# EasyEDA Pro project Schematic.epro

# Schematic Schematic1
Board Name: Board1; Create Date: 2026-07-30; Page Name: P1; Project Name: USB HUB; Schematic Name: Schematic1; Update Date: 2026-07-30; Company: EasyEDA.com; Page Size: A4; Version: V1.0
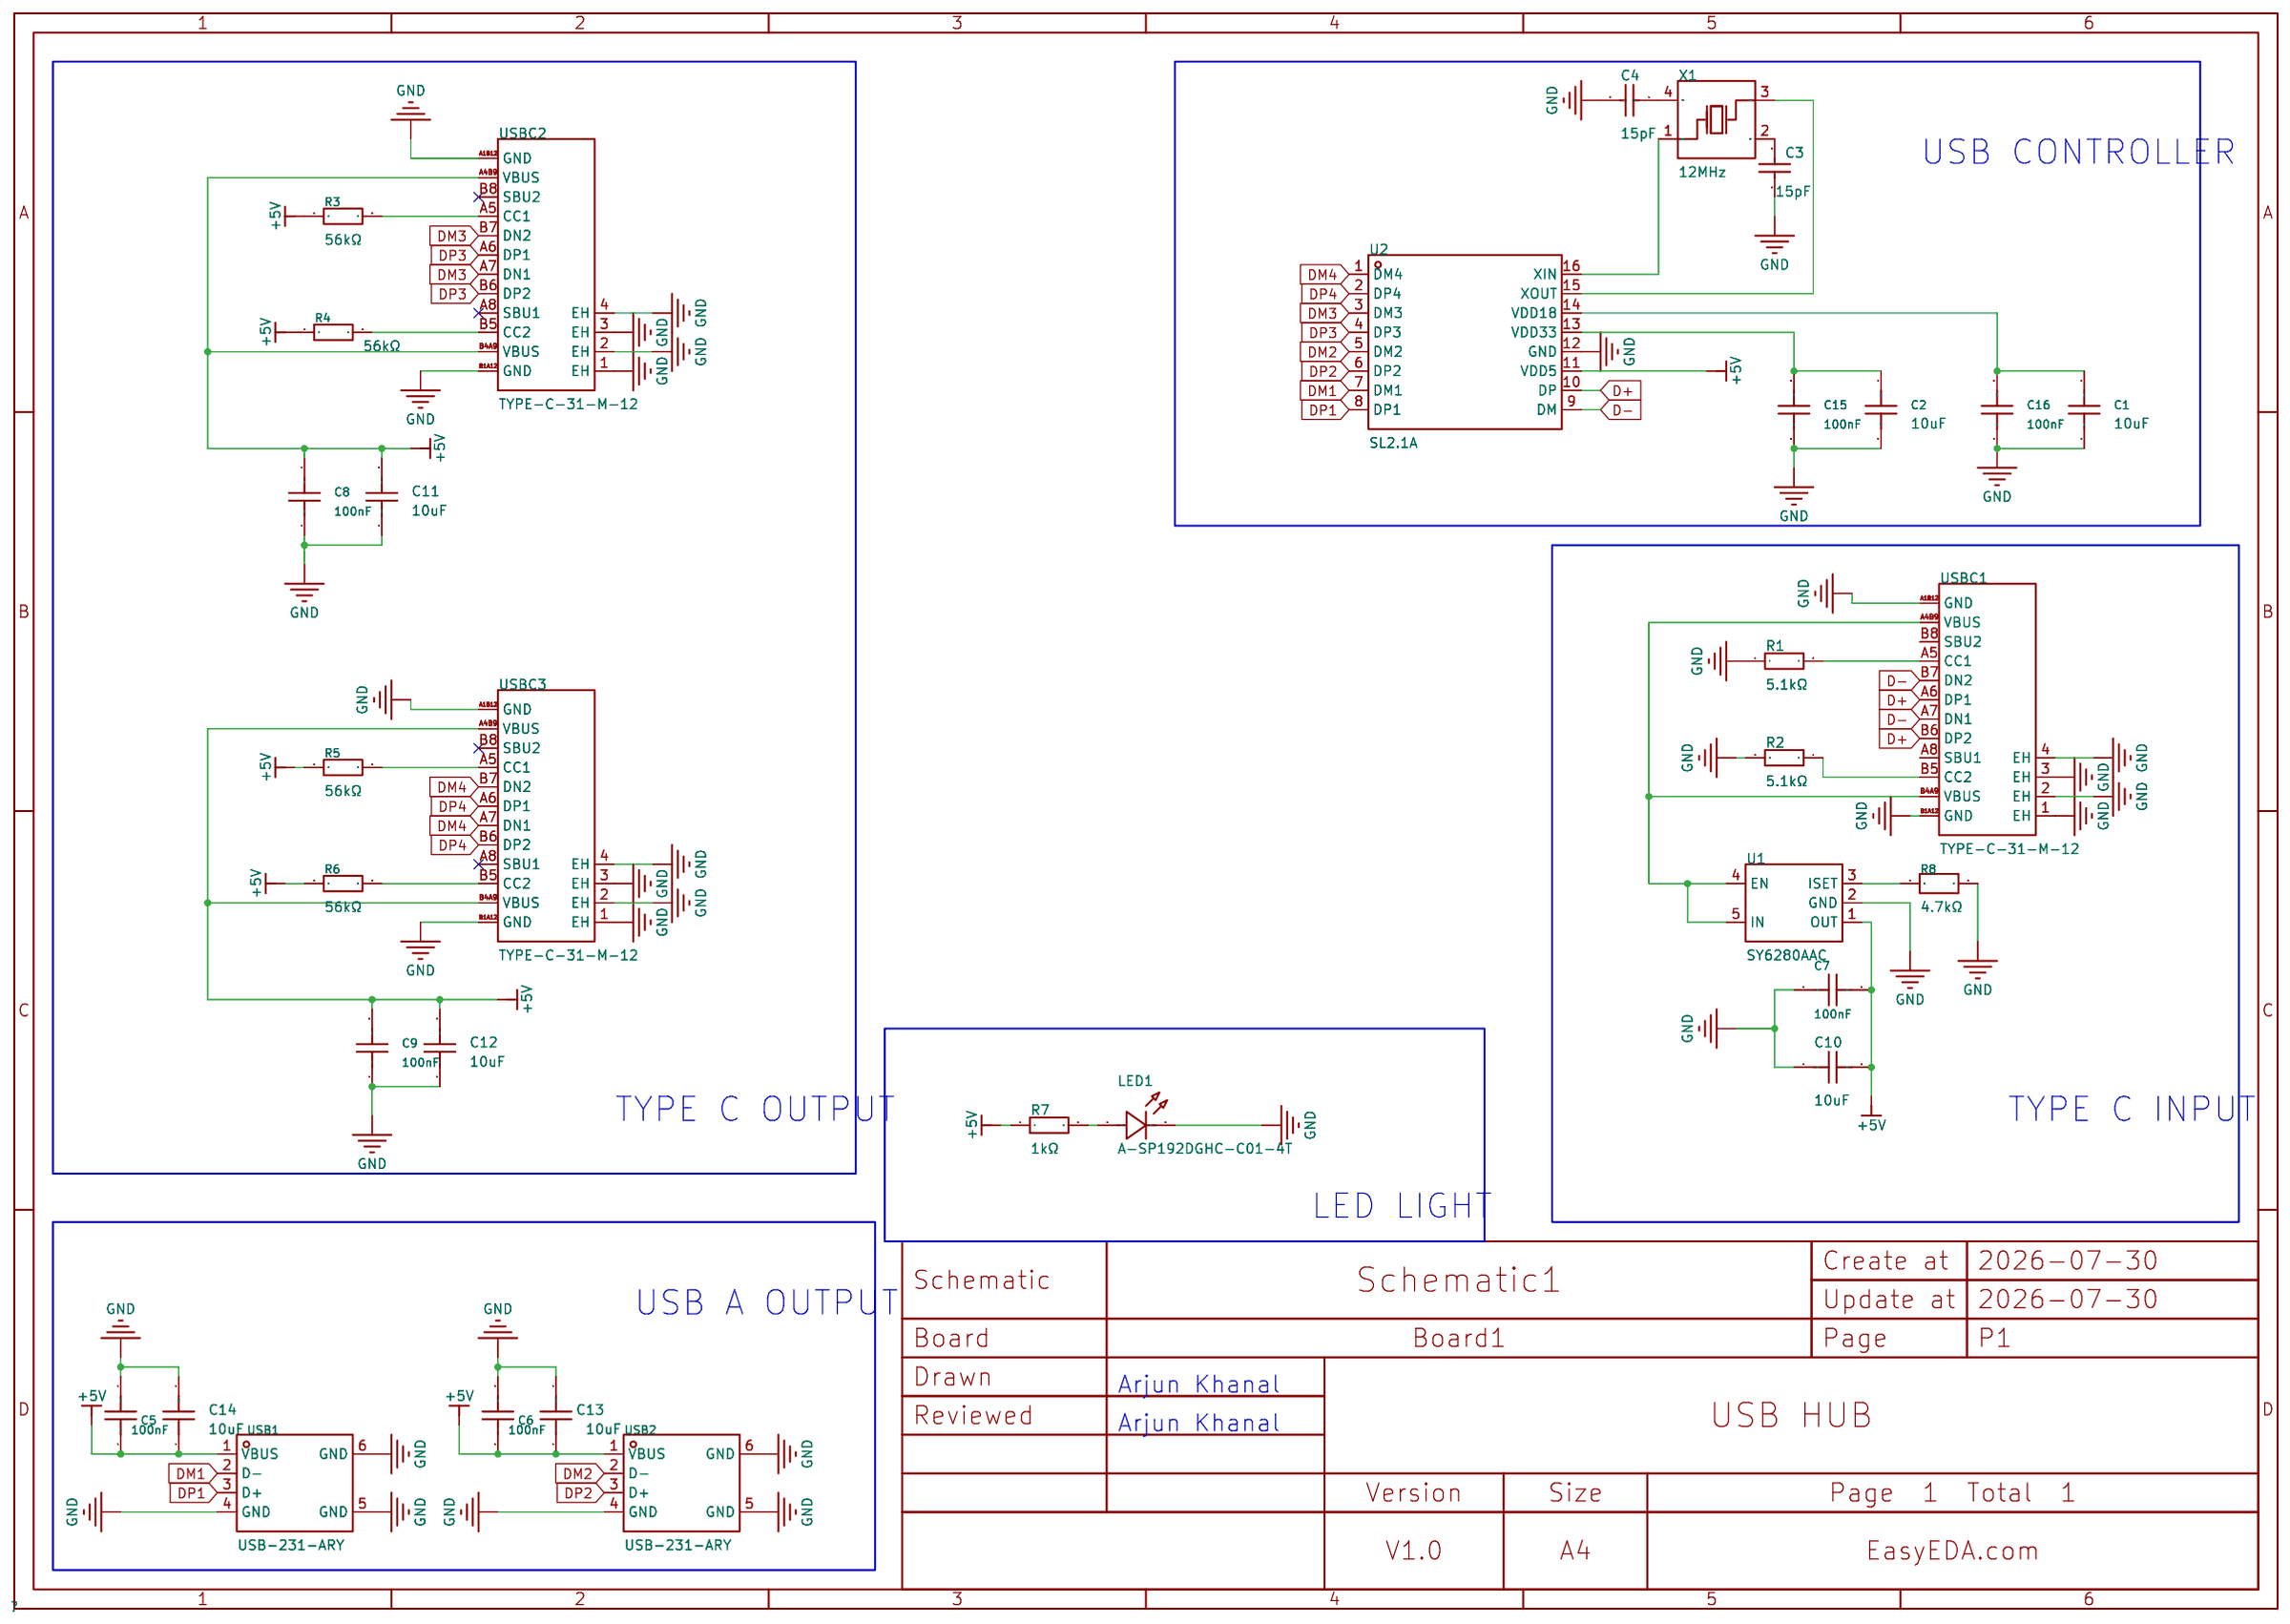
[diagram p0: schematic sheet]

## Parts
C1  10uF  [C0603]
C2  10uF  [C0603]
C3  15pF  [C0603]
C4  15pF  [C0603]
C5  100nF  [C0603]
C6  100nF  [C0603]
C7  100nF  [C0603]
C8  100nF  [C0603]
C9  100nF  [C0603]
C10  10uF  [C0805]
C11  10uF  [C0805]
C12  10uF  [C0805]
C13  10uF  [C0805]
C14  10uF  [C0805]
C15  100nF  [C0603]
C16  100nF  [C0603]
LED1  A-SP192DGHC-C01-4T  [LED0603-FD]
R1  5.1kΩ  [R0603]
R2  5.1kΩ  [R0603]
R3  56kΩ  [R0603]
R4  56kΩ  [R0603]
R5  56kΩ  [R0603]
R6  56kΩ  [R0603]
R7  1kΩ  [R0805]
R8  4.7kΩ  [R0603]
U1  SY6280AAC  [SOT-23-5_L3.0-W1.7-P0.95-LS2.8-BL]
U2  SL2.1A  [SOP-16_L10.0-W3.9-P1.27-LS6.0-BL]
USB1  USB-231-ARY  [USB-A-TH_USB-231-ARY]
USB2  USB-231-ARY  [USB-A-TH_USB-231-ARY]
USBC1  TYPE-C-31-M-12  [USB-C_SMD-TYPE-C-31-M-12_1]
USBC2  TYPE-C-31-M-12  [USB-C_SMD-TYPE-C-31-M-12_1]
USBC3  TYPE-C-31-M-12  [USB-C_SMD-TYPE-C-31-M-12_1]
X1  12MHz  [CRYSTAL-SMD_4P-L3.2-W2.5-BL]

## Library data of the parts
C1 C2 = CL10A106MA8NRNC: Capacitance:10uF Tolerance:±20% Tolerance:±20% Voltage Rating:25V Temperature Coefficient:X5R; LCSC Part Name: 10uF ±20% 25V; Supplier Part: C96446; Manufacturer: SAMSUNG(三星); Supplier Footprint: 0603; JLCPCB Part Class: Basic Part; Datasheet: https://item.szlcsc.com/datasheet/CL10A106MA8NRNC/97651.html; Supplier: LCSC; Tolerance: ±20%; Voltage Rating: 25V; Temperature Coefficient: X5R
C3 C4 = CL10C150JB8NNNC: Capacitance:15pF Tolerance:±5% Tolerance:±5% Voltage Rating:50V Temperature Coefficient:C0G; LCSC Part Name: 15pF ±5% 50V; Supplier Part: C1644; Manufacturer: SAMSUNG(三星); Supplier Footprint: 0603; JLCPCB Part Class: Basic Part; Datasheet: https://item.szlcsc.com/datasheet/CL10C150JB8NNNC/1996.html; Supplier: LCSC; Tolerance: ±5%; Voltage Rating: 50V; Temperature Coefficient: C0G
C5-C9 C15 C16 = CC0603KRX7R9BB104: Capacitance:100nF Tolerance:±10% Tolerance:±10% Voltage Rating:50V Temperature Coefficient:X7R; LCSC Part Name: 100nF ±10% 50V; Supplier Part: C14663; Manufacturer: YAGEO(国巨); Supplier Footprint: 0603; JLCPCB Part Class: Basic Part; Datasheet: https://item.szlcsc.com/datasheet/CC0603KRX7R9BB104/15331.html; Supplier: LCSC; Tolerance: ±10%; Voltage Rating: 50V; Temperature Coefficient: X7R
C10-C14 = CL21A106KAYNNNE_C15850: Capacitance:10uF Tolerance:±10% Tolerance:±10% Voltage Rating:25V Temperature Coefficient:X5R; LCSC Part Name: 10uF ±10% 25V; Supplier Part: C15850; Manufacturer: SAMSUNG(三星); Manufacturer Part: CL21A106KAYNNNE; Supplier Footprint: 0805; JLCPCB Part Class: Basic Part; Datasheet: https://item.szlcsc.com/datasheet/CL21A106KAYNNNE/16532.html; Supplier: LCSC; Tolerance: ±10%; Voltage Rating: 25V; Temperature Coefficient: X5R
LED1 = A-SP192DGHC-C01-4T: Lamp Holder Type:- Illumination Color:Emerald Green Voltage - Forward(Vf):2.4V~3V Voltage - Forward(Vf):2.4V~3V Power(Watts):70mW Forward Current:5mA Wavelength - Dominant:520nm~535nm Wavelength - Dominant:520nm~535nm Peak Wavelength:518nm Diode Configura; LCSC Part Name: 0603高亮绿灯正贴; Supplier Part: C19171301; Manufacturer: Amicc(欧密格光电); Supplier Footprint: 0603; JLCPCB Part Class: Extended Part; Datasheet: https://item.szlcsc.com/datasheet/A-SP192DGHC-C01-4T/20382208.html; Supplier: LCSC; Illumination Color: Emerald Green; Voltage - Forward(Vf): 2.4V~3V; Power(Watts): 70mW; Forward Current: 5mA; Wavelength - Dominant: 520nm~535nm; Peak Wavelength: 518nm; Diode Configuration: Discrete Diode; Lens Color: Water Clear; Luminous Intensity: 450mcd; Viewing Angle: 120°; Mounting Style: Top-mount; Operating Temperature: -40℃~+85℃
R1 R2 = 0603WAF5101T5E: Type:Thick Film Resistor Resistance:5.1kΩ Tolerance:±1% Tolerance:±1% Power(Watts):100mW Voltage-Supply(Max):75V Temperature Coefficient:±100ppm/℃ Temperature Coefficient:±100ppm/℃ Operating Temperature:-55℃~+155℃ Operating Temperature:-55℃~+155℃; LCSC Part Name: 5.1kΩ ±1% 100mW 厚膜电阻; Supplier Part: C23186; Manufacturer: UNI-ROYAL(厚声); Supplier Footprint: 0603; JLCPCB Part Class: Basic Part; Datasheet: https://item.szlcsc.com/datasheet/0603WAF5101T5E/23913.html; Supplier: LCSC; Type: Thick Film Resistor; Tolerance: ±1%; Power(Watts): 100mW; Voltage-Supply(Max): 75V; Temperature Coefficient: ±100ppm/℃; Operating Temperature: -55℃~+155℃
R3-R6 = 0603WAF5602T5E: Type:Thick Film Resistor Resistance:56kΩ Tolerance:±1% Tolerance:±1% Power(Watts):100mW Voltage-Supply(Max):75V Temperature Coefficient:±100ppm/℃ Temperature Coefficient:±100ppm/℃ Operating Temperature:-55℃~+155℃ Operating Temperature:-55℃~+155℃; LCSC Part Name: 56kΩ ±1% 100mW 厚膜电阻; Supplier Part: C23206; Manufacturer: UNI-ROYAL(厚声); Supplier Footprint: 0603; JLCPCB Part Class: Basic Part; Datasheet: https://item.szlcsc.com/datasheet/0603WAF5602T5E/23933.html; Supplier: LCSC; Type: Thick Film Resistor; Tolerance: ±1%; Power(Watts): 100mW; Voltage-Supply(Max): 75V; Temperature Coefficient: ±100ppm/℃; Operating Temperature: -55℃~+155℃
R7 = RC0805FR-071KL: Type:Thick Film Resistors Resistance: Tolerance:±1% Tolerance:±1% Power(Watts): Overload Voltage (Max): Temperature Coefficient:±100ppm/℃ Temperature Coefficient:±100ppm/℃ Operating Temperature Range:-55℃~+155℃ Operating Temperature Range:-55℃~+155℃; LCSC Part Name: 厚膜电阻 1kΩ ±1% 125mW; Supplier Part: C95781; Manufacturer: YAGEO(国巨); Supplier Footprint: 0805; JLCPCB Part Class: Extended Part; Datasheet: https://atta.szlcsc.com/upload/public/pdf/source/20170708/1499509500945.pdf; Supplier: LCSC; Type: Thick Film Resistors; Tolerance: ±1%; Temperature Coefficient: ±100ppm/℃; Operating Temperature Range: -55℃~+155℃
R8 = HoLTT0603-1/10W-4.7K-1%: Type:Thick Film Resistor Resistance:4.7kΩ Tolerance:±1% Tolerance:±1% Power(Watts):100mW Voltage-Supply(Max):75V Temperature Coefficient:±100ppm/℃ Temperature Coefficient:±100ppm/℃ Operating Temperature:-55℃~+155℃ Operating Temperature:-55℃~+155℃; LCSC Part Name: 4.7kΩ ±1% 100mW; Supplier Part: C2904521; Manufacturer: Milliohm(毫欧); Supplier Footprint: 0603; JLCPCB Part Class: Extended Part; Datasheet: https://item.szlcsc.com/datasheet/HoLTT0603-1%252F10W-4.7K-1%2525/3164221.html; Supplier: LCSC; Type: Thick Film Resistor; Tolerance: ±1%; Power(Watts): 100mW; Voltage-Supply(Max): 75V; Temperature Coefficient: ±100ppm/℃; Operating Temperature: -55℃~+155℃
U1 = SY6280AAC_C55136: Type:High Side Switch Number of Channels:1 Control Input Logic:Active High Voltage - Supply:2.4V~5.5V Voltage - Supply:2.4V~5.5V Maximum Continuous Current:2A RDS(on):80mΩ Features:Short-Circuit  Protection；Overcurrent Protection；Reverse current blocking；; LCSC Part Name: 低损耗功率分配开关; Supplier Part: C55136; Manufacturer: Silergy(矽力杰); Supplier Footprint: SOT-23-5; JLCPCB Part Class: Extended Part; Datasheet: https://item.szlcsc.com/datasheet/SY6280AAC/56162.html; Supplier: LCSC; Type: High Side Switch; Number of Channels: 1; Control Input Logic: Active High; Voltage - Supply: 2.4V~5.5V; Maximum Continuous Current: 2A; RDS(on): 80mΩ; Features: Short-Circuit  Protection；Overcurrent Protection；Reverse current blocking；Output discharge function；Over temperature protection; Operating Temperature	-: -40℃~+125℃
U2 = SL2.1A: type:Hub USB Protocol:USB 2.0 Voltage - Supply:4V~5.25V Voltage - Supply:4V~5.25V Operating Temperature:0℃~+70℃ Operating Temperature:0℃~+70℃ Current - Supply:120mA Quiescent Supply Current:2.5mA Number of Channels:4 Features:Internal regulator；ESD protec; LCSC Part Name: USB2.0高速4端口HUB控制器 停产; Supplier Part: C192893; Manufacturer: CoreChips(和芯润德); Supplier Footprint: SOP-16; JLCPCB Part Class: Extended Part; Datasheet: https://item.szlcsc.com/datasheet/SL2.1A/225853.html; Supplier: LCSC; type: Hub; USB Protocol: USB 2.0; Voltage - Supply: 4V~5.25V; Operating Temperature: 0℃~+70℃; Current - Supply: 120mA; Quiescent Supply Current: 2.5mA; Number of Channels: 4; Features: Internal regulator；ESD protection；Low-power mode；Power-on reset；BC1.2 protocol support
USB1 USB2 = USB-231-ARY: Connector Type:Type-A Protocol Standard:USB 2.0 Gender:Female Mounting Type:Right Angle Number of Contacts:4P Number of Ports:1 Current Rating-Power:1.5A Voltage Rating:30V Length:14.2mm Detection color:White Operating Temperature:-20℃~+70℃ Operating Temp; LCSC Part Name: Type-A 母 弯插; Supplier Part: C720525; Manufacturer: XUNPU(讯普); Supplier Footprint: 弯插; JLCPCB Part Class: Extended Part; Datasheet: https://item.szlcsc.com/datasheet/USB-231-ARY/763532.html; Supplier: LCSC; Connector Type: Type-A; Protocol Standard: USB 2.0; Gender: Female; Mounting Type: Right Angle; Number of Contacts: 4P; Number of Ports: 1; Current Rating-Power: 1.5A; Voltage Rating: 30V; Length: 14.2mm; Detection color: White; Operating Temperature: -20℃~+70℃
USBC1-USBC3 = TYPE-C-31-M-12: Connector Type:Type-C Protocol Standard:- Gender:Female Mounting Type:Surface Mount, Right Angle Number of Contacts:16P Number of Ports:1 Current Rating-Power:5A Voltage Rating:20V Connect-Disconnect Life:10,000 cycles Length:7.35mm Operating Temperature:; LCSC Part Name: Type-C 母 卧贴; Supplier Part: C165948; Manufacturer: 韩国韩荣; Supplier Footprint: SMD; JLCPCB Part Class: Extended Part; Datasheet: https://item.szlcsc.com/datasheet/TYPE-C-31-M-12/177331.html; Supplier: LCSC; Connector Type: Type-C; Gender: Female; Mounting Type: Surface Mount, Right Angle; Number of Contacts: 16P; Number of Ports: 1; Current Rating-Power: 5A; Voltage Rating: 20V; Connect-Disconnect Life: 10,000 cycles; Length: 7.35mm; Operating Temperature: -30℃~+80℃
X1 = X322512MSB4SI: Type:Crystal Oscillator Frequency:12MHz Normal temperature Frequency Tolerance:±10ppm Normal temperature Frequency Tolerance:±10ppm Load Capacitance:20pF Frequency Stability:±20ppm Frequency Stability:±20ppm Operating Temperature:-40℃~+85℃ Operating Tempe; LCSC Part Name: YSX321SL 12MHZ 4P 3225 20PF ±10PPM -40~85℃ (±20PPM); Supplier Part: C9002; Manufacturer: YXC(扬兴晶振); Supplier Footprint: SMD3225-4P; JLCPCB Part Class: Basic Part; Datasheet: https://item.szlcsc.com/datasheet/X322512MSB4SI/9522.html; Supplier: LCSC; Type: Crystal Oscillator; Normal temperature Frequency Tolerance: ±10ppm; Load Capacitance: 20pF; Frequency Stability: ±20ppm; Operating Temperature: -40℃~+85℃

## Nets
+5V: C5.1 C6.1 C7.2 C8.2 C9.2 C10.2 C11.2 C12.2 C13.1 C14.1 R3.1 R4.1 R5.1 R6.1 R7.1 U1.1(OUT) U2.11(VDD5) USB1.1(VBUS) USB2.1(VBUS) USBC2.A4B9(VBUS) USBC2.B4A9(VBUS) USBC3.A4B9(VBUS) USBC3.B4A9(VBUS)
GND: C1.2 C2.2 C3.1 C4.2 C5.2 C6.2 C7.1 C8.1 C9.1 C10.1 C11.1 C12.1 C13.2 C14.2 C15.1 C16.1 LED1.2(K) R1.1 R2.2 R8.2 U1.2(GND) U2.12(GND) USB1.4(GND) USB1.5(GND) USB1.6(GND) USB2.4(GND) USB2.5(GND) USB2.6(GND) USBC1.1(EH) USBC1.2(EH) USBC1.3(EH) USBC1.4(EH) USBC1.A1B12(GND) USBC1.B1A12(GND) USBC2.1(EH) USBC2.2(EH) USBC2.3(EH) USBC2.4(EH) USBC2.A1B12(GND) USBC2.B1A12(GND) USBC3.1(EH) USBC3.2(EH) USBC3.3(EH) USBC3.4(EH) USBC3.A1B12(GND) USBC3.B1A12(GND)
D+: U2.10(DP) USBC1.A6(DP1) USBC1.B6(DP2)
D-: U2.9(DM) USBC1.A7(DN1) USBC1.B7(DN2)
DM1: U2.7(DM1) USB1.2(D-)
DM2: U2.5(DM2) USB2.2(D-)
DM3: U2.3(DM3) USBC2.A7(DN1) USBC2.B7(DN2)
DM4: U2.1(DM4) USBC3.A7(DN1) USBC3.B7(DN2)
DP1: U2.8(DP1) USB1.3(D+)
DP2: U2.6(DP2) USB2.3(D+)
DP3: U2.4(DP3) USBC2.A6(DP1) USBC2.B6(DP2)
DP4: U2.2(DP4) USBC3.A6(DP1) USBC3.B6(DP2)
Net-(C1-1): C1.1 C16.2 U2.14(VDD18)
Net-(C2-1): C2.1 C15.2 U2.13(VDD33)
Net-(C3-2): C3.2 X1.2(GND)
Net-(C4-1): C4.1 X1.4(GND)
Net-(LED1-1): LED1.1(A) R7.2
Net-(R1-2): R1.2 USBC1.A5(CC1)
Net-(R2-1): R2.1 USBC1.B5(CC2)
Net-(R3-2): R3.2 USBC2.A5(CC1)
Net-(R4-2): R4.2 USBC2.B5(CC2)
Net-(R5-2): R5.2 USBC3.A5(CC1)
Net-(R6-2): R6.2 USBC3.B5(CC2)
Net-(R8-1): R8.1 U1.3(ISET)
Net-(U1-4): U1.4(EN) U1.5(IN) USBC1.A4B9(VBUS) USBC1.B4A9(VBUS)
Net-(U2-15): U2.15(XOUT) X1.3(OSC2)
Net-(U2-16): U2.16(XIN) X1.1(OSC1)

Not connected (* = marked no-connect by the designer): USBC1 A8(SBU1) B8(SBU2); USBC2 A8(SBU1)* B8(SBU2)*; USBC3 A8(SBU1)* B8(SBU2)*

## Notes on the sheet
- USB CONTROLLER
- TYPE C OUTPUT
- TYPE C INPUT
- LED LIGHT
- USB A OUTPUT
- Arjun Khanal
- Arjun Khanal
